# EAGLE design Main Board (EAGLE 5.10)
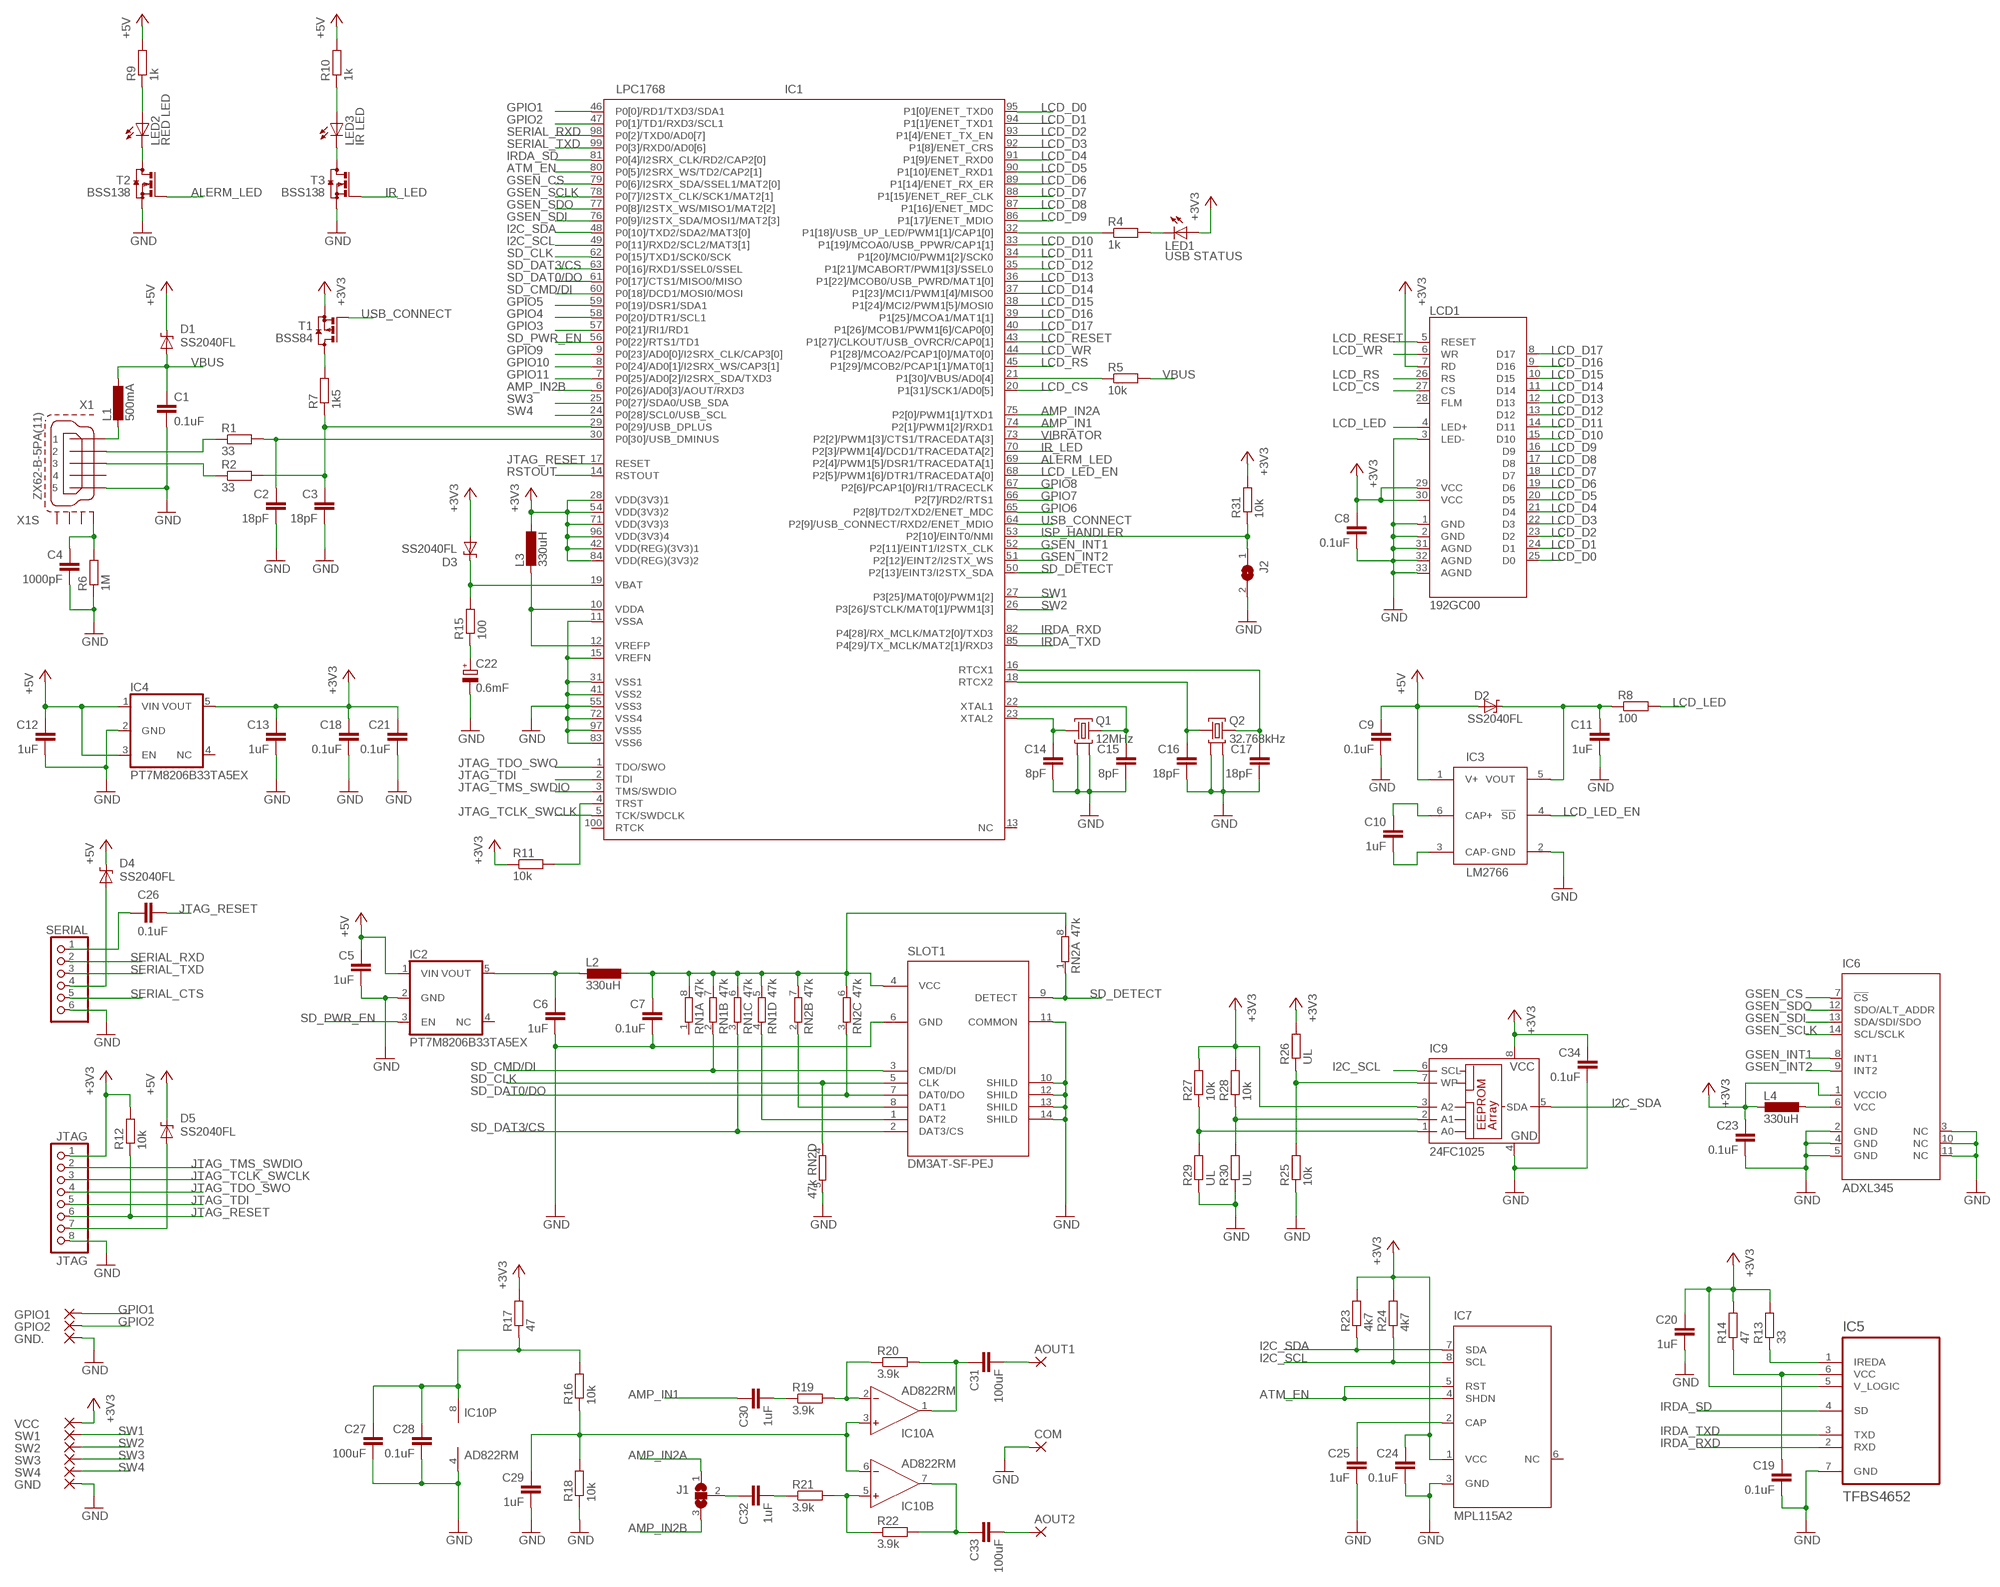
[diagram p0: schematic, sheet 1]

## Parts
AOUT1  SMD2  [SMD1,27-2,54]
AOUT2  SMD2  [SMD1,27-2,54]
C1  0.1uF  C-EUC0402  [C0402]
C2  18pF  C-EUC0402  [C0402]
C3  18pF  C-EUC0402  [C0402]
C4  1000pF  C-EUC0402  [C0402]
C5  1uF  C-EUC0402  [C0402]
C6  1uF  C-EUC0402  [C0402]
C7  0.1uF  C-EUC0402  [C0402]
C8  0.1uF  C-EUC0402  [C0402]
C9  0.1uF  C-EUC0402  [C0402]
C10  1uF  C-EUC0402  [C0402]
C11  1uF  C-EUC0402  [C0402]
C12  1uF  C-EUC0402  [C0402]
C13  1uF  C-EUC0402  [C0402]
C14  8pF  C-EUC0402  [C0402]
C15  8pF  C-EUC0402  [C0402]
C16  18pF  C-EUC0402  [C0402]
C17  18pF  C-EUC0402  [C0402]
C18  0.1uF  C-EUC0402  [C0402]
C19  0.1uF  C-EUC0402  [C0402]
C20  1uF  C-EUC0402  [C0402]
C21  0.1uF  C-EUC0402  [C0402]
C22  0.6mF  PAS414HR-VA5R  [414-VA5R]
C23  0.1uF  C-EUC0402  [C0402]
C24  0.1uF  C-EUC0402  [C0402]
C25  1uF  C-EUC0402  [C0402]
C26  0.1uF  C-EUC0402  [C0402]
C27  100uF  C-EUC1206  [C1206]
C28  0.1uF  C-EUC0402  [C0402]
C29  1uF  C-EUC0402  [C0402]
C30  1uF  C-EUC0402  [C0402]
C31  100uF  C-EUC1206  [C1206]
C32  1uF  C-EUC0402  [C0402]
C33  100uF  C-EUC1206  [C1206]
C34  0.1uF  C-EUC0402  [C0402]
COM  SMD2  [SMD1,27-2,54]
D1  SS2040FL  [SOD-123FL]
D2  SS2040FL  [SOD-123FL]
D3  SS2040FL  [SOD-123FL]
D4  SS2040FL  [SOD-123FL]
D5  SS2040FL  [SOD-123FL]
GND  SMD2  [SMD1,27-2,54]
GND.  SMD2  [SMD1,27-2,54]
GPIO1  SMD2  [SMD1,27-2,54]
GPIO2  SMD2  [SMD1,27-2,54]
IC1  LPC1768  [LQFP100-14X14]
IC2  PT7M8206B33TA5EX  [SOT23-5L]
IC3  LM2766  [SOT23-6]
IC4  PT7M8206B33TA5EX  [SOT23-5L]
IC5  TFBS4652  [TFBS4652]
IC6  ADXL345  [LGA14]
IC7  MPL115A2  [LGA8]
IC9  24FC1025  24AA01SN  [SO-08]
IC10  AD822RM  [MSOP08]
J1  SJ2W  [SJ_2]
J2  SJ  [SJ]
JTAG  JTAG  PINHD-1X8  [1X08]
L1  500mA  L-EUL1812  [L1812]
L2  330uH  L-EUL2012C  [L2012C]
L3  330uH  L-EUL2012C  [L2012C]
L4  330uH  L-EUL2012C  [L2012C]
LCD1  192GC00  [192GC00]
LED1  USB STATUS  LEDCHIP-LED0603  [CHIP-LED0603]
LED2  RED LED  LEDKA-3528ASYC  [KA-3528ASYC]
LED3  IR LED  LEDKA-3528ASYC  [KA-3528ASYC]
Q1  12MHz  NX3225SA  [DFN]
Q2  32.768kHz  ECX-71  [DFN]
R1  33  R-EU_R0402  [R0402]
R2  33  R-EU_R0402  [R0402]
R4  1k  R-EU_R0402  [R0402]
R5  10k  R-EU_R0402  [R0402]
R6  1M  R-EU_R0402  [R0402]
R7  1k5  R-EU_R0402  [R0402]
R8  100  R-EU_R0603  [R0603]
R9  1k  R-EU_R0402  [R0402]
R10  1k  R-EU_R0402  [R0402]
R11  10k  R-EU_R0402  [R0402]
R12  10k  R-EU_R0402  [R0402]
R13  33  R-EU_R0402  [R0402]
R14  47  R-EU_R0402  [R0402]
R15  100  R-EU_R0402  [R0402]
R16  10k  R-EU_R0402  [R0402]
R17  47  R-EU_R0402  [R0402]
R18  10k  R-EU_R0402  [R0402]
R19  3.9k  R-EU_R0402  [R0402]
R20  3.9k  R-EU_R0402  [R0402]
R21  3.9k  R-EU_R0402  [R0402]
R22  3.9k  R-EU_R0402  [R0402]
R23  4k7  R-EU_R0402  [R0402]
R24  4k7  R-EU_R0402  [R0402]
R25  10k  R-EU_R0402  [R0402]
R26  UL  R-EU_R0402  [R0402]
R27  10k  R-EU_R0402  [R0402]
R28  10k  R-EU_R0402  [R0402]
R29  UL  R-EU_R0402  [R0402]
R30  UL  R-EU_R0402  [R0402]
R31  10k  R-EU_R0402  [R0402]
RN1  47k  4R-NEXBN8V  [EXBN8V]
RN2  47k  4R-NEXBN8V  [EXBN8V]
SERIAL  PINHD-1X6  [1X06]
SLOT1  DM3AT-SF-PEJ  [DM3AT-SF-PEJ]
SW1  SMD2  [SMD1,27-2,54]
SW2  SMD2  [SMD1,27-2,54]
SW3  SMD2  [SMD1,27-2,54]
SW4  SMD2  [SMD1,27-2,54]
T1  BSS84  [SOT23]
T2  BSS138  BSS123  [SOT23]
T3  BSS138  BSS123  [SOT23]
VCC  SMD2  [SMD1,27-2,54]
X1  ZX62-B-5PA(11)  [ZX62-B-5PA(11)]

## Nets
+3V3: C8.1 C13.1 C18.1 C20.1 C21.1 C23.1 C24.1 C34.1 D3.A IC1.28(VDD(3V3)1) IC1.42(VDD(REG)(3V3)1) IC1.54(VDD(3V3)2) IC1.71(VDD(3V3)3) IC1.84(VDD(REG)(3V3)2) IC1.96(VDD(3V3)4) IC4.5(VOUT) IC5.5(V_LOGIC) IC6.1(VCCIO) IC7.1(VCC) IC9.3(A2) IC9.8(VCC) JTAG.1 L3.1 L4.2 LCD1.7(RD) LCD1.29(VCC) LCD1.30(VCC) LED1.A R11.1 R12.2 R13.2 R14.2 R17.2 R23.2 R24.2 R26.2 R27.2 R28.2 R31.2 T1.2(S) VCC.1(P)
+5V: C5.1 C9.1 C12.1 D1.C D2.A D4.C D5.C IC2.1(VIN) IC3.1(V+) IC4.1(VIN) IC4.3(EN) R9.2 R10.2
ALERM_LED: IC1.69(P2[4]/PWM1[5]/DSR1/TRACEDATA[1]) T2.1(G)
AMP_IN1: C30.1 IC1.74(P2[1]/PWM1[2]/RXD1)
AMP_IN2A: IC1.75(P2[0]/PWM1[1]/TXD1) J1.1
AMP_IN2B: IC1.6(P0[26]/AD0[3]/AOUT/RXD3) J1.3
ATM_EN: IC1.80(P0[5]/I2SRX_WS/TD2/CAP2[1]) IC7.4(SHDN) IC7.5(RST)
EXT_POWER: D5.A JTAG.7
GND: C1.2 C2.2 C3.2 C4.2 C5.2 C6.2 C7.2 C8.2 C9.2 C11.2 C12.2 C13.2 C14.2 C15.2 C16.2 C17.2 C18.2 C19.2 C20.2 C21.2 C22.- C23.2 C24.2 C25.2 C27.2 C28.2 C29.2 C34.2 COM.1(P) GND.1(P) GND..1(P) IC1.11(VSSA) IC1.15(VREFN) IC1.31(VSS1) IC1.41(VSS2) IC1.55(VSS3) IC1.72(VSS4) IC1.83(VSS6) IC1.97(VSS5) IC2.2(GND) IC3.2(GND) IC4.2(GND) IC5.7(GND) IC6.2(GND) IC6.3(NC) IC6.4(GND) IC6.5(GND) IC6.10(NC) IC6.11(NC) IC7.3(GND) IC9.4(GND) IC10.4(P:V-) J2.2 JTAG.8 LCD1.1(GND) LCD1.2(GND) LCD1.3(LED-) LCD1.31(AGND) LCD1.32(AGND) LCD1.33(AGND) Q1.2 Q1.4 Q2.2 Q2.3 R6.1 R18.1 R25.1 R29.1 R30.1 RN2.5 SERIAL.6 SLOT1.6(GND) SLOT1.10(SHILD) SLOT1.11(COMMON) SLOT1.12(SHILD) SLOT1.13(SHILD) SLOT1.14(SHILD) T2.2(S) T3.2(S) X1.5
GPIO1: GPIO1.1(P) IC1.46(P0[0]/RD1/TXD3/SDA1)
GPIO2: GPIO2.1(P) IC1.47(P0[1]/TD1/RXD3/SCL1)
GPIO3: IC1.57(P0[21]/RI1/RD1)
GPIO4: IC1.58(P0[20]/DTR1/SCL1)
GPIO5: IC1.59(P0[19]/DSR1/SDA1)
GPIO6: IC1.65(P2[8]/TD2/TXD2/ENET_MDC)
GPIO7: IC1.66(P2[7]/RD2/RTS1)
GPIO8: IC1.67(P2[6]/PCAP1[0]/RI1/TRACECLK)
GPIO9: IC1.9(P0[23]/AD0[0]/I2SRX_CLK/CAP3[0])
GPIO10: IC1.8(P0[24]/AD0[1]/I2SRX_WS/CAP3[1])
GPIO11: IC1.7(P0[25]/AD0[2]/I2SRX_SDA/TXD3)
GSEN_CS: IC1.79(P0[6]/I2SRX_SDA/SSEL1/MAT2[0]) IC6.7(!CS)
GSEN_INT1: IC1.52(P2[11]/EINT1/I2STX_CLK) IC6.8(INT1)
GSEN_INT2: IC1.51(P2[12]/EINT2/I2STX_WS) IC6.9(INT2)
GSEN_SCLK: IC1.78(P0[7]/I2STX_CLK/SCK1/MAT2[1]) IC6.14(SCL/SCLK)
GSEN_SDI: IC1.76(P0[9]/I2STX_SDA/MOSI1/MAT2[3]) IC6.13(SDA/SDI/SDO)
GSEN_SDO: IC1.77(P0[8]/I2STX_WS/MISO1/MAT2[2]) IC6.12(SDO/ALT_ADDR)
I2C_SCL: IC1.49(P0[11]/RXD2/SCL2/MAT3[1]) IC7.8(SCL) IC9.6(SCL) R24.1
I2C_SDA: IC1.48(P0[10]/TXD2/SDA2/MAT3[0]) IC7.7(SDA) IC9.5(SDA) R23.1
IR_LED: IC1.70(P2[3]/PWM1[4]/DCD1/TRACEDATA[2]) T3.1(G)
IRDA_RXD: IC1.82(P4[28]/RX_MCLK/MAT2[0]/TXD3) IC5.2(RXD)
IRDA_SD: IC1.81(P0[4]/I2SRX_CLK/RD2/CAP2[0]) IC5.4(SD)
IRDA_TXD: IC1.85(P4[29]/TX_MCLK/MAT2[1]/RXD3) IC5.3(TXD)
ISP_HANDLER: IC1.53(P2[10]/EINT0/NMI) J2.1 R31.1
JTAG_RESET: C26.2 IC1.17(RESET) JTAG.6 R12.1
JTAG_TCLK_SWCLK: IC1.5(TCK/SWDCLK) JTAG.3
JTAG_TDI: IC1.2(TDI) JTAG.5
JTAG_TDO_SWO: IC1.1(TDO/SWO) JTAG.4
JTAG_TMS_SWDIO: IC1.3(TMS/SWDIO) JTAG.2
LCD_CS: IC1.20(P1[31]/SCK1/AD0[5]) LCD1.27(CS)
LCD_D0: IC1.95(P1[0]/ENET_TXD0) LCD1.25(D0)
LCD_D1: IC1.94(P1[1]/ENET_TXD1) LCD1.24(D1)
LCD_D2: IC1.93(P1[4]/ENET_TX_EN) LCD1.23(D2)
LCD_D3: IC1.92(P1[8]/ENET_CRS) LCD1.22(D3)
LCD_D4: IC1.91(P1[9]/ENET_RXD0) LCD1.21(D4)
LCD_D5: IC1.90(P1[10]/ENET_RXD1) LCD1.20(D5)
LCD_D6: IC1.89(P1[14]/ENET_RX_ER) LCD1.19(D6)
LCD_D7: IC1.88(P1[15]/ENET_REF_CLK) LCD1.18(D7)
LCD_D8: IC1.87(P1[16]/ENET_MDC) LCD1.17(D8)
LCD_D9: IC1.86(P1[17]/ENET_MDIO) LCD1.16(D9)
LCD_D10: IC1.33(P1[19]/MCOA0/USB_PPWR/CAP1[1]) LCD1.15(D10)
LCD_D11: IC1.34(P1[20]/MCI0/PWM1[2]/SCK0) LCD1.14(D11)
LCD_D12: IC1.35(P1[21]/MCABORT/PWM1[3]/SSEL0) LCD1.13(D12)
LCD_D13: IC1.36(P1[22]/MCOB0/USB_PWRD/MAT1[0]) LCD1.12(D13)
LCD_D14: IC1.37(P1[23]/MCI1/PWM1[4]/MISO0) LCD1.11(D14)
LCD_D15: IC1.38(P1[24]/MCI2/PWM1[5]/MOSI0) LCD1.10(D15)
LCD_D16: IC1.39(P1[25]/MCOA1/MAT1[1]) LCD1.9(D16)
LCD_D17: IC1.40(P1[26]/MCOB1/PWM1[6]/CAP0[0]) LCD1.8(D17)
LCD_LED: LCD1.4(LED+) R8.2
LCD_LED_EN: IC1.68(P2[5]/PWM1[6]/DTR1/TRACEDATA[0]) IC3.4(!SD)
LCD_RESET: IC1.43(P1[27]/CLKOUT/USB_OVRCR/CAP0[1]) LCD1.5(RESET)
LCD_RS: IC1.45(P1[29]/MCOB2/PCAP1[1]/MAT0[1]) LCD1.26(RS)
LCD_WR: IC1.44(P1[28]/MCOA2/PCAP1[0]/MAT0[0]) LCD1.6(WR)
N$1: C4.1 R6.2 X1.M1(S1)
N$2: R1.1 X1.2
N$3: R2.1 X1.3
N$4: L1.2 X1.1
N$5: D3.C IC1.19(VBAT) R15.2
N$6: R7.2 T1.3(D)
N$7: C3.1 IC1.29(P0[29]/USB_DPLUS) R2.2 R7.1
N$8: IC1.10(VDDA) IC1.12(VREFP) L3.2
N$9: C2.1 IC1.30(P0[30]/USB_DMINUS) R1.2
N$10: C10.2 IC3.3(CAP-)
N$11: C15.1 IC1.22(XTAL1) Q1.3
N$12: C14.1 IC1.23(XTAL2) Q1.1
N$13: IC1.32(P1[18]/USB_UP_LED/PWM1[1]/CAP1[0]) R4.1
N$14: LED1.C R4.2
N$15: C17.1 IC1.16(RTCX1) Q2.1
N$16: C16.1 IC1.18(RTCX2) Q2.4
N$17: C10.1 IC3.6(CAP+)
N$18: IC1.4(TRST) R11.2
N$19: D4.A SERIAL.4
N$20: C11.1 D2.C IC3.5(VOUT) R8.1
N$21: C22.+ R15.1
N$22: IC1.21(P1[30]/VBUS/AD0[4]) R5.1
N$23: IC6.6(VCC) L4.1
N$24: C19.1 IC5.6(VCC) R14.1
N$25: C6.1 IC2.5(VOUT) L2.2
N$27: C26.1 SERIAL.1
N$28: C32.1 J1.2
N$30: LED3.C T3.3(D)
N$31: LED2.C T2.3(D)
N$32: IC9.1(A0) R27.1 R29.2
N$33: IC9.2(A1) R28.1 R30.2
N$34: LED3.A R10.1
N$35: IC5.1(IREDA) R13.1
N$40: AOUT1.1(P) C31.2
N$41: LED2.A R9.1
N$43: IC9.7(WP) R25.2 R26.1
N$51: IC10.2(A:IN-) R19.2 R20.1
N$52: IC10.5(B:IN+) R21.2 R22.1
N$53: C30.2 R19.1
N$54: C32.2 R21.1
N$56: C27.1 C28.1 IC10.8(P:V+) R16.2 R17.1
N$57: C29.1 IC10.3(A:IN+) IC10.6(B:IN-) R16.1 R18.2
N$58: AOUT2.1(P) C33.2
N$59: C33.1 IC10.7(B:OUT) R22.2
N$60: C31.1 IC10.1(A:OUT) R20.2
N$63: C25.1 IC7.2(CAP)
RSTOUT: IC1.14(RSTOUT)
SD_CLK: IC1.62(P0[15]/TXD1/SCK0/SCK) RN2.4 SLOT1.5(CLK)
SD_CMD/DI: IC1.60(P0[18]/DCD1/MOSI0/MOSI) RN1.2 SLOT1.3(CMD/DI)
SD_DAT0/DO: IC1.61(P0[17]/CTS1/MISO0/MISO) RN2.3 SLOT1.7(DAT0/DO)
SD_DAT1: RN2.2 SLOT1.8(DAT1)
SD_DAT2: RN1.4 SLOT1.1(DAT2)
SD_DAT3/CS: IC1.63(P0[16]/RXD1/SSEL0/SSEL) RN1.3 SLOT1.2(DAT3/CS)
SD_DETECT: IC1.50(P2[13]/EINT3/I2STX_SDA) RN2.1 SLOT1.9(DETECT)
SD_PWR_EN: IC1.56(P0[22]/RTS1/TD1) IC2.3(EN)
SERIAL_CTS: SERIAL.5
SERIAL_RXD: IC1.98(P0[2]/TXD0/AD0[7]) SERIAL.2
SERIAL_TXD: IC1.99(P0[3]/RXD0/AD0[6]) SERIAL.3
SW1: IC1.27(P3[25]/MAT0[0]/PWM1[2]) SW1.1(P)
SW2: IC1.26(P3[26]/STCLK/MAT0[1]/PWM1[3]) SW2.1(P)
SW3: IC1.25(P0[27]/SDA0/USB_SDA) SW3.1(P)
SW4: IC1.24(P0[28]/SCL0/USB_SCL) SW4.1(P)
USB_CONNECT: IC1.64(P2[9]/USB_CONNECT/RXD2/ENET_MDIO) T1.1(G)
VBUS: C1.1 D1.A L1.1 R5.2
VCC: C7.1 L2.1 RN1.5 RN1.6 RN1.7 RN1.8 RN2.6 RN2.7 RN2.8 SLOT1.4(VCC)
VIBRATOR: IC1.73(P2[2]/PWM1[3]/CTS1/TRACEDATA[3])
Unconnected: IC1.13(NC) IC1.100(RTCK) IC2.4(NC) IC4.4(NC) IC7.6(NC) LCD1.28(FLM) RN1.1 X1.4 X1.M2(S2) X1.M3(S3) X1.M4(S4)

## Library data of the parts
AOUT1 AOUT2 COM GND GND. GPIO1 GPIO2 SW1-SW4 VCC = wirepad:SMD2: SMD PAD
C1-C21 C23-C34 = resistor:C-EU: CAPACITOR, European symbol
C22 = taiyo yuden:PAS414HR-VA5R: Coin Type PAS Capacitor 414-VE5R Voltage: 3.3V Capacitor: 60mF Diameter: 4.8mm Height: 1.62mm
D1-D5 = PANJIT:SS2040FL: Schottky Barrier Diode 40V 2.0A
IC1 = lpc1xxx-v6:LPC1768: LPC1768 100 MHz 32-bit ARM Cortex-M3 based microcontroller featuring a high level of integration and low power consumption. 512 kB Flash, 64 kB SRAM, USB Device/Host/OTG, 2 CAN, DAC, Ethernet MarcVl - Datasheet available on www.nxp.com
IC2 IC4 = pericom technology:PT7M8206B33TA5EX: 300mA Low Noise LDO Voltage Regulator with Enable Source: http://www.pti-ic.com/new/manage/doc_datasheet/PT0359%20PT7M8206-1.pdf
IC3 = national_semiconductor:LM2766: Switched Capacitor Voltage Converter Manufacturer: http://cache.national.com Source: http://www.national.com/ds/LM/LM2766.pdf
IC5 = Vishay Semiconductors:TFBS4652: Infrared Transceiver, 9.6 kbit/s to 115.2 kbit/s (SIR) source: http://www.vishay.com/docs/84671/tfbs4652.pdf
IC6 = analog-devices:ADXL345: ADXL345 3-Axis, 2g/4g/8g/16g Digital Accelerometer in LGA14 Package Voltage: 2.0V-3.6V SPI(3-4wire), I2C
IC7 = Freescale:MPL115A2: Miniature I2C Digital Barometer in LGA8 Package - Digitized pressure and temperature information together with programmed calibration coefficients for host micro use - Factory Calibrated - 50 kPa to 115 kPa Absolute Pressure - 1 kPa Accuracy - 2.375 V to 5.5 V Supply - Integrated ADC - I2C Interface - Monotonic Pressure and Temperature Data Outputs
IC9 = microchip:24*: Serial EEPROM I2C
IC10 = analog-devices:AD822: Single-Supply, Rail-to-Rail Low Power FET-Input Op Amp Source: http://www.analog.com/static/imported-files/data_sheets/AD822.pdf
J1 = jumper:SJ2W: SMD solder JUMPER
J2 = jumper:SJ: SMD solder JUMPER
JTAG = pinheader:PINHD-1X8: PIN HEADER
L1-L4 = resistor:L-EU: INDUCTOR, European symbol
LCD1 = repro:192GC00: TFT DISPLAY 192GC00 320x240 262K color
LED1-LED3 = led:LED: LED OSRAM: - CHIPLED LG R971, LG N971, LY N971, LG Q971, LY Q971, LO R971, LY R971 LH N974, LH R974 LS Q976, LO Q976, LY Q976 LO Q996 - Hyper CHIPLED LW Q18S LB Q993, LB Q99A, LB R99A - SideLED LS A670, LO A670, LY A670, LG A670, LP A670 LB A673, LV A673, LT A673, LW A673 LH A674 LY A675 LS A676, LA A676, LO A676, LY A676, LW A676 LS A679, LY A679, LG A679 - Hyper Micro SIDELED® LS Y876, LA Y876, LO Y876, LY Y876 LT Y87S - SmartLED LW L88C, LW L88S LB L89C, LB L89S, LG L890 LS L89K, LO L89K, LY L89K LS L896, LA L896, LO L896, LY L896 - TOPLED LS T670, LO T670, LY T670, LG T670, LP T670 LSG T670, LSP T670, LSY T670, LOP T670, LYG T670 LG T671, LOG T671, LSG T671 LB T673, LV T673, LT T673, LW T673 LH T674 LS T676, LA T676, LO T676, LY T676, LB T676, LH T676, LSB T676, LW T676 LB T67C, LV T67C, LT T67C, LS T67K, LO T67K, LY T67K, LW E67C LS E67B, LA E67B, LO E67B, LY E67B, LB E67C, LV E67C, LT E67C LW T67C LS T679, LY T679, LG T679 LS T770, LO T770, LY T770, LG T770, LP T770 LB T773, LV T773, LT T773, LW T773 LH T774 LS E675, LA E675, LY E675, LS T675 LS T776, LA T776, LO T776, LY T776, LB T776 LHGB T686 LT T68C, LB T68C - Hyper Mini TOPLED® LB M676 - Mini TOPLED Santana® LG M470 LS M47K, LO M47K, LY M47K Source: http://www.osram.convergy.de LUXEON: - LUMILED® LXK2-PW12-R00, LXK2-PW12-S00, LXK2-PW14-U00, LXK2-PW14-V00 LXK2-PM12-R00, LXK2-PM12-S00, LXK2-PM14-U00 LXK2-PE12-Q00, LXK2-PE12-R00, LXK2-PE12-S00, LXK2-PE14-T00, LXK2-PE14-U00 LXK2-PB12-K00, LXK2-PB12-L00, LXK2-PB12-M00, LXK2-PB14-N00, LXK2-PB14-P00, LXK2-PB14-Q00 LXK2-PR12-L00, LXK2-PR12-M00, LXK2-PR14-Q00, LXK2-PR14-R00 LXK2-PD12-Q00, LXK2-PD12-R00, LXK2-PD12-S00 LXK2-PH12-R00, LXK2-PH12-S00 LXK2-PL12-P00, LXK2-PL12-Q00, LXK2-PL12-R00 Source: www.luxeon.com KINGBRIGHT: KA-3528ASYC Source: www.kingbright.com
Q1 = NDK:NX3225SA: CRYSTAL CLOCK OSCILLATORS
Q2 = ECS:ECX-71: CRYSTAL CLOCK OSCILLATORS 32.768kHz
R1 R2 R4-R31 = resistor:R-EU_: RESISTOR, European symbol
RN1 RN2 = resistor-dil:4R-N: Array Chip Resistor Source: RS Component / Phycomp
SERIAL = pinheader:PINHD-1X6: PIN HEADER
SLOT1 = hirose:DM3AT-SF-PEJ: micro SD Card (Standard Type) Source: http://www.hirose.co.jp/catalogj_hp/j60900232.pdf
T1 = transistor-small-signal:BSS84: P-CHANNEL MOS FET
T2 T3 = transistor-small-signal:BSS123: N-CHANNEL MOS FET
X1 = micro-usb:ZX62-B-5PA(11): MICRO USB Connector

## Board
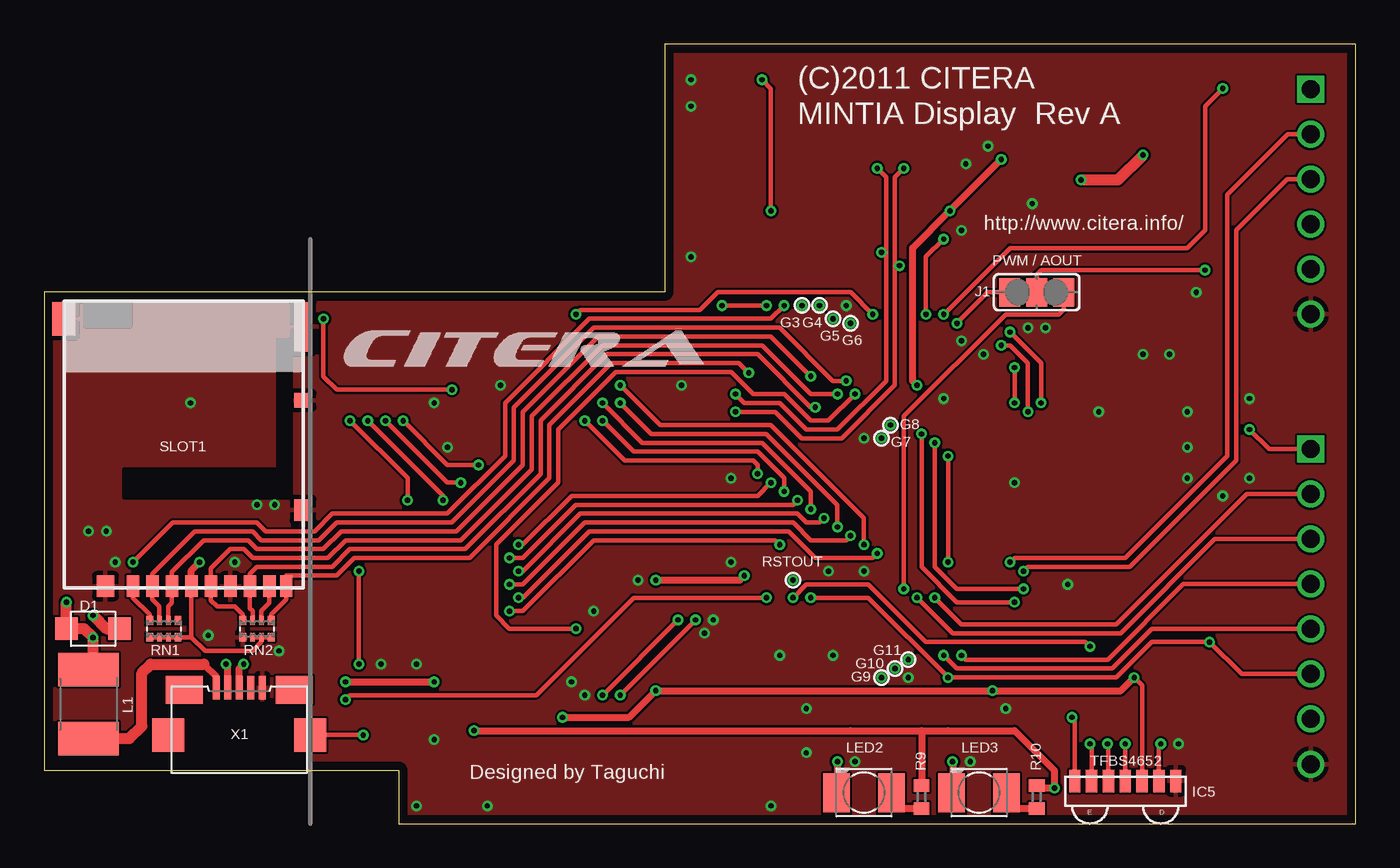
[diagram p1: board, top side]
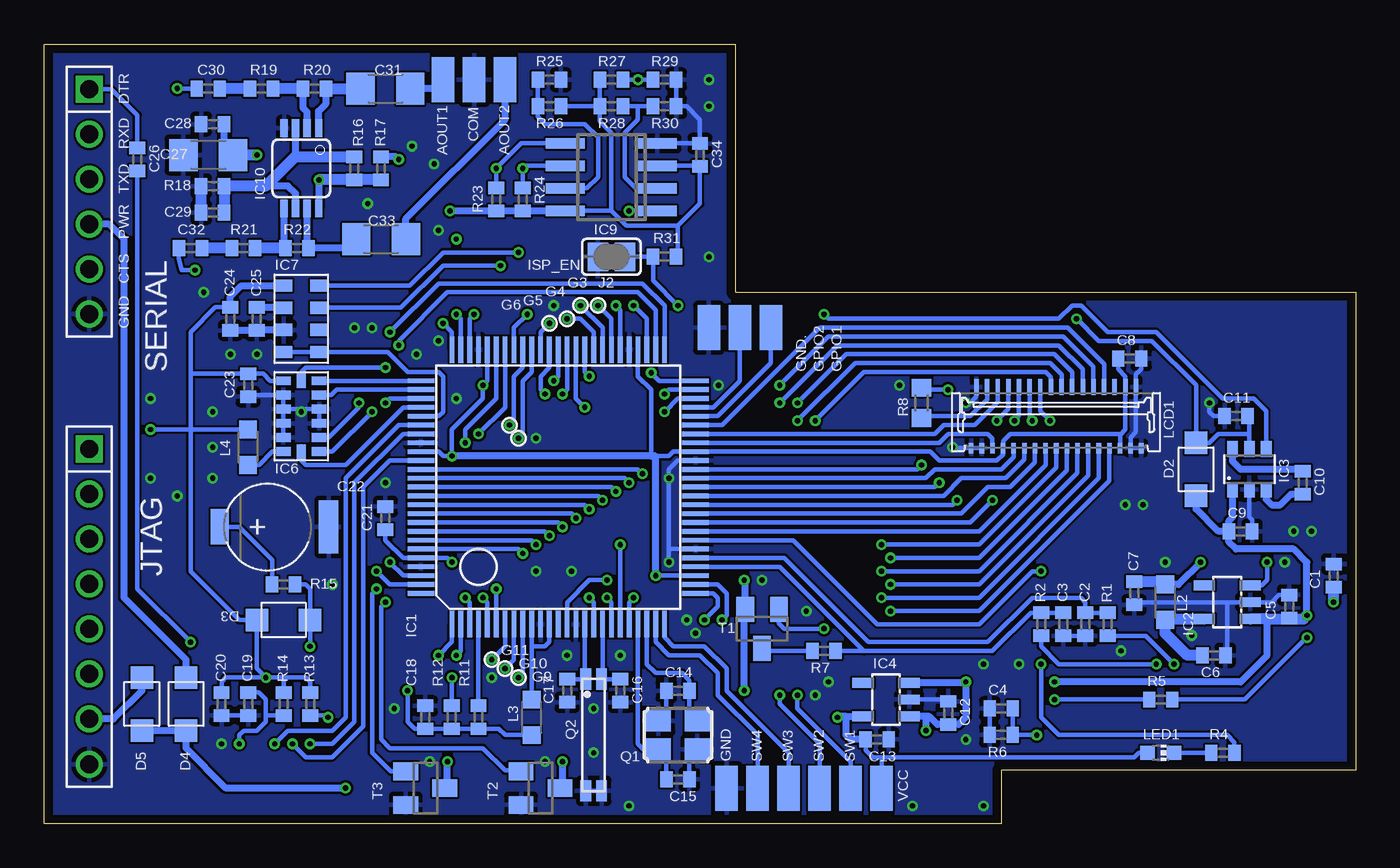
[diagram p2: board, bottom side, seen from below]

Size 74 x 44 mm. Coordinates in mm from the lower left corner, seen from the top.
Outline: 74,44 35,44 35,30 0,30 0,3 20,3 20,0 74,0 74,44
Copper layers (1+2*15+16): Top 0.018mm / dielectric 0.25mm / Route2 0.035mm / dielectric 1mm / Route15 0.035mm / dielectric 0.25mm / Bottom 0.018mm
Design rules "pban_5mil-l4": minimum track width 5mil, minimum drill 0.3mm, track to track 5mil, track to pad 0.229mm, pad to pad 5mil, via to via 5mil, smd to smd 5mil, copper to edge 0.5mm, drill to drill 0.5mm, minimum pad ring 0.15mm, minimum via ring 0.15mm, stop-mask expansion 4mil, vias tented up to drill 0.35mm, thermal gap 10mil

### Footprints (pad centres in the part's own frame; a part is rotated, then mirrored left to right if it is on the bottom)
SMD1,27-2,54 = smd 1.27 x 2.54: 1 0,0
C0402 = smd 0.7 x 0.9: 1 -0.65,0; 2 0.65,0
414-VA5R = smd 1 x 2: + -2.6,0 | smd 1.1 x 3: - 3.55,0
C1206 = smd 1.6 x 1.8: 1 -1.4,0; 2 1.4,0
SOD-123FL = smd 1.27 x 1.27: A 1.5,0; C -1.5,0
LQFP100-14X14 = smd 0.27 x 1.5: 1 -6,-7.75; 2 -5.5,-7.75; 3 -5,-7.75; 4 -4.5,-7.75; 5 -4,-7.75; 6 -3.5,-7.75; 7 -3,-7.75; 8 -2.5,-7.75; 9 -2,-7.75; 10 -1.5,-7.75; 11 -1,-7.75; 12 -0.5,-7.75; 13 0,-7.75; 14 0.5,-7.75; 15 1,-7.75; 16 1.5,-7.75; 17 2,-7.75; 18 2.5,-7.75; 19 3,-7.75; 20 3.5,-7.75; 21 4,-7.75; 22 4.5,-7.75; 23 5,-7.75; 24 5.5,-7.75; 25 6,-7.75; 51 6,7.75; 52 5.5,7.75; 53 5,7.75; 54 4.5,7.75; 55 4,7.75; 56 3.5,7.75; 57 3,7.75; 58 2.5,7.75; 59 2,7.75; 60 1.5,7.75; 61 1,7.75; 62 0.5,7.75; 63 0,7.75; 64 -0.5,7.75; 65 -1,7.75; 66 -1.5,7.75; 67 -2,7.75; 68 -2.5,7.75; 69 -3,7.75; 70 -3.5,7.75; 71 -4,7.75; 72 -4.5,7.75; 73 -5,7.75; 74 -5.5,7.75; 75 -6,7.75 | smd 1.5 x 0.27: 26 7.75,-6; 27 7.75,-5.5; 28 7.75,-5; 29 7.75,-4.5; 30 7.75,-4; 31 7.75,-3.5; 32 7.75,-3; 33 7.75,-2.5; 34 7.75,-2; 35 7.75,-1.5; 36 7.75,-1; 37 7.75,-0.5; 38 7.75,0; 39 7.75,0.5; 40 7.75,1; 41 7.75,1.5; 42 7.75,2; 43 7.75,2.5; 44 7.75,3; 45 7.75,3.5; 46 7.75,4; 47 7.75,4.5; 48 7.75,5; 49 7.75,5.5; 50 7.75,6; 76 -7.75,6; 77 -7.75,5.5; 78 -7.75,5; 79 -7.75,4.5; 80 -7.75,4; 81 -7.75,3.5; 82 -7.75,3; 83 -7.75,2.5; 84 -7.75,2; 85 -7.75,1.5; 86 -7.75,1; 87 -7.75,0.5; 88 -7.75,0; 89 -7.75,-0.5; 90 -7.75,-1; 91 -7.75,-1.5; 92 -7.75,-2; 93 -7.75,-2.5; 94 -7.75,-3; 95 -7.75,-3.5; 96 -7.75,-4; 97 -7.75,-4.5; 98 -7.75,-5; 99 -7.75,-5.5; 100 -7.75,-6
SOT23-5L = smd 0.55 x 1.2: 1 -0.95,-1.3; 2 0,-1.3; 3 0.95,-1.3; 4 0.95,1.3; 5 -0.95,1.3
SOT23-6 = smd 0.6 x 0.9: 1 -0.95,-1.15; 2 0,-1.15; 3 0.95,-1.15; 4 0.95,1.15; 5 0,1.15; 6 -0.95,1.15
TFBS4652 = smd 0.64 x 1.27: 1 2.85,-0.665; 2 1.9,-0.665; 3 0.95,-0.665; 4 0,-0.665; 5 -0.95,-0.665; 6 -1.9,-0.665; 7 -2.85,-0.665
LGA14 = smd 0.813 x 0.5: 1 -1.01,2; 2 -1.01,1.2; 3 -1.01,0.4; 4 -1.01,-0.4; 5 -1.01,-1.2; 6 -1.01,-2; 8 1.01,-2; 9 1.01,-1.2; 10 1.01,-0.4; 11 1.01,0.4; 12 1.01,1.2; 13 1.01,2 | smd 0.5 x 0.813: 7 0,-2.01; 14 0,2.01
LGA8 = smd 1 x 0.7: 1 -1,1.875; 2 -1,0.625; 3 -1,-0.625; 4 -1,-1.875; 5 1,-1.875; 6 1,-0.625; 7 1,0.625; 8 1,1.875
SO-08 = smd 0.6 x 2.2: 1 -1.905,-2.6; 2 -0.635,-2.6; 3 0.635,-2.6; 4 1.905,-2.6; 5 1.905,2.6; 6 0.635,2.6; 7 -0.635,2.6; 8 -1.905,2.6
MSOP08 = smd 0.4 x 1: 1 -0.976,-2.263; 2 -0.326,-2.263; 3 0.324,-2.263; 4 0.974,-2.263; 5 0.974,2.262; 6 0.324,2.262; 7 -0.326,2.262; 8 -0.976,2.262
SJ_2 = smd 1.168 x 1.6: 1 -1.524,0; 2 0,0; 3 1.524,0
SJ = smd 1.168 x 1.6: 1 -0.762,0; 2 0.762,0
1X08 = drill 1.016 square: 1 -8.89,0 | drill 1.016 round: 2 -6.35,0; 3 -3.81,0; 4 -1.27,0; 5 1.27,0; 6 3.81,0; 7 6.35,0; 8 8.89,0
L1812 = smd 1.9 x 3.4: 1 -1.95,0; 2 1.95,0
L2012C = smd 1 x 1: 1 -1,0; 2 1,0
192GC00 = smd 0.6 x 0.26: 1 -1.8,5.7; 3 -1.8,5.1; 5 -1.8,4.5; 7 -1.8,3.9; 9 -1.8,3.3; 11 -1.8,2.7; 13 -1.8,2.1; 15 -1.8,1.5; 17 -1.8,0.9; 19 -1.8,0.3; 21 -1.8,-0.3; 23 -1.8,-0.9; 25 -1.8,-1.5; 27 -1.8,-2.1; 29 -1.8,-2.7; 31 -1.8,-3.3; 33 -1.8,-3.9 | smd 0.9 x 0.25: 2 1.65,5.4; 4 1.65,4.8; 6 1.65,4.2; 8 1.65,3.6; 10 1.65,3; 12 1.65,2.4; 14 1.65,1.8; 16 1.65,1.2; 18 1.65,0.6; 20 1.65,0; 22 1.65,-0.6; 24 1.65,-1.2; 26 1.65,-1.8; 28 1.65,-2.4; 30 1.65,-3; 32 1.65,-3.6
CHIP-LED0603 = smd 0.8 x 0.8: A 0,-0.75; C 0,0.75
KA-3528ASYC = smd 1.5 x 2.2: A -1.55,0; C 1.55,0
DFN = smd 1.4 x 1.2: 1 -1.1,-0.8; 2 1.1,-0.8; 3 1.1,0.8; 4 -1.1,0.8
DFN' = smd 1.2 x 0.6: 1 -3.15,-0.45; 2 3.15,-0.45; 3 3.15,0.45; 4 -3.15,0.45
R0402 = smd 0.7 x 0.9: 1 -0.65,0; 2 0.65,0
R0603 = smd 1 x 1.1: 1 -0.85,0; 2 0.85,0
EXBN8V = smd 0.38 x 0.5: 1 -0.8,-0.475; 4 0.8,-0.475; 5 0.8,0.475; 8 -0.8,0.475 | smd 0.25 x 0.5: 2 -0.25,-0.475; 3 0.25,-0.475; 6 0.25,0.475; 7 -0.25,0.475
1X06 = drill 1.016 square: 1 -6.35,0 | drill 1.016 round: 2 -3.81,0; 3 -1.27,0; 4 1.27,0; 5 3.81,0; 6 6.35,0
DM3AT-SF-PEJ = smd 0.7 x 1.2: 1 0,0.6; 2 -1.1,0.6; 3 -2.2,0.6; 4 -3.3,0.6; 5 -4.4,0.6; 6 -5.5,0.6; 7 -6.6,0.6; 8 -7.7,0.6; 9 -8.65,0.6 | smd 1 x 1.2: 10 -9.6,-3.7; 14 1.55,0.6 | smd 1 x 0.8: 11 -9.6,-9.9 | smd 1 x 2.8: 12 -9.6,-14.05 | smd 1.3 x 1.9: 13 3.9,-14.5
SOT23 = smd 1 x 1.4: 1 -0.95,-1.1; 2 0.95,-1.1; 3 0,1.1
ZX62-B-5PA(11) = smd 1.35 x 0.4: 1 2.675,1.3; 2 2.675,0.65; 3 2.675,0; 4 2.675,-0.65; 5 2.675,-1.3 | smd 1.9 x 1.8: M1 0,-4; M2 0,4 | smd 1.6 x 2.1: M3 2.55,3.1; M4 2.55,-3.1

### Placement (x,y rotation side)
AOUT1  51.5,42 180 bottom
AOUT2  48,42 180 bottom
C1  1.25,14 90 bottom
C2  15.25,11.25 270 bottom
C3  16.5,11.25 270 bottom
C4  20,6.5 180 bottom
C5  3.75,12.25 90 bottom
C6  8,9.5 0 bottom
C7  12.5,13 270 bottom
C8  12.75,26.25 0 bottom
C9  6.5,16.5 0 bottom
C10  3,19.25 270 bottom
C11  6.75,23 180 bottom
C12  23,6.25 90 bottom
C13  27,4.75 0 bottom
C14  38.25,7.5 180 bottom
C15  38.25,2.5 0 bottom
C16  41.5,7.5 270 bottom
C17  44.5,7.5 270 bottom
C18  52.5,6 90 bottom
C19  62.5,6.75 270 bottom
C20  64,6.75 270 bottom
C21  54.75,17.25 90 bottom
C22  61.5,16.75 0 bottom
C23  62.5,24.75 270 bottom
C24  63.5,28.5 270 bottom
C25  62,28.5 270 bottom
C26  68.75,37.5 270 bottom
C27  64.75,37.75 180 bottom
C28  64.5,39.5 180 bottom
C29  64.5,34.5 180 bottom
C30  64.75,41.5 0 bottom
C31  54.75,41.5 0 bottom
C32  65.75,32.5 0 bottom
C33  55,33 0 bottom
C34  37,37.75 90 bottom
COM  49.75,42 180 bottom
D1  2.75,11 180 top
D2  9,20 270 bottom
D3  60.5,11.5 180 bottom
D4  66,6.75 90 bottom
D5  68.5,6.75 90 bottom
GND  35.5,2 180 bottom
GND.  36.5,28 180 bottom
GPIO1  33,28 180 bottom
GPIO2  34.75,28 180 bottom
IC1  45,19 0 bottom
IC2  7.25,12.5 90 bottom
IC3  6,20 0 bottom
IC4  26.5,7 90 bottom
IC5  61,1.75 180 top
IC6  59.5,23 0 bottom
IC7  59.5,28.5 0 bottom
IC9  42,36.5 90 bottom
IC10  59.5,37 180 bottom
J1  56,30 0 top
J2  42,32 180 bottom
JTAG  71.46,12.25 270 bottom
L1  2.5,6.75 270 top
L2  10.75,12.5 270 bottom
L3  46.5,6 90 bottom
L4  62.5,21.25 90 bottom
LCD1  16,23 90 bottom
LED1  11,4 270 bottom
LED2  46.25,1.75 180 top
LED3  52.75,1.75 180 top
Q1  38.25,5 180 bottom
Q2  32.768kHz  [DFN']  43,5 270 bottom
R1  14,11.25 90 bottom
R2  17.75,11.25 90 bottom
R4  7.5,4 180 bottom
R5  11,7 0 bottom
R6  20,5 0 bottom
R7  30,9.75 180 bottom
R8  24.5,23.75 270 bottom
R9  49.5,1.5 90 top
R10  56,1.5 90 top
R11  49.5,6 90 bottom
R12  51,6 270 bottom
R13  59,6.75 90 bottom
R14  60.5,6.75 90 bottom
R15  60.5,13.5 0 bottom
R16  56.5,37 270 bottom
R17  55,37 90 bottom
R18  64.5,36 0 bottom
R19  61.75,41.5 0 bottom
R20  58.75,41.5 0 bottom
R21  62.75,32.5 0 bottom
R22  59.75,32.5 0 bottom
R23  48.5,35.25 270 bottom
R24  47,35.25 270 bottom
R25  45.5,42 180 bottom
R26  45.5,40.5 0 bottom
R27  42,42 180 bottom
R28  42,40.5 180 bottom
R29  39,42 180 bottom
R30  39,40.5 180 bottom
R31  39,32 0 bottom
RN1  6.75,11 180 top
RN2  12,11 180 top
SERIAL  71.46,35.11 270 bottom
SLOT1  5,14 180 top
SW1  28.5,2 180 bottom
SW2  30.25,2 180 bottom
SW3  32,2 180 bottom
SW4  33.75,2 180 bottom
T1  33.5,11 180 bottom
T2  46,2 270 bottom
T3  52.5,2 270 bottom
U$1  [CITERA]  16.5,25.5 0 top
VCC  26.75,2 180 bottom
X1  11,5 90 top

### Tracks (layer width: path | path; a pad name or v marks a point on that pad's centre or on a via)
+3V3  (via drill 0.3)
  Top 0.254: v51,20.75 v51,14.75 | IC5.5 61.95,7.8 v61.5,8.25 | v68,22.25 69.11,21.14 JTAG.1
  Top 0.406: v61.5,8.25 60.75,7.5 v53.5,7.5 v34.5,7.5 33,6 v29.25,6 | v34.5,13.75 39.25,13.75 v39.5,14 | v49.25,24.75 49,25 49,32.5 v51.1,34.6 v54,37.5
  Bottom 0.254: 13.3,21.95 LCD1.29 | 13.3,21.95 13,22.25 LCD1.30 13,25.25 13.4,25.65 C8.1 | 13.3,21.95 13.35,22 19.5,22 19.9,21.6 LCD1.7 19.9,20.85 20.25,20.5 23.5,20.5 24,21 IC1.42 38.5,21 38.75,20.75 39.5,20.75 | IC9.3 37,37.13 C34.1 37,35 38.25,33.75 | R28.2 R27.2 | 42,34.59 42,39 42.65,39.65 R28.2 | IC9.8 42,34.59 | 42,34.59 41.16,33.75 38.25,33.75 | IC6.1 61.25,25 61.65,25.4 C23.1 65.75,25.4 | v39.5,14 IC1.28 | 39.75,20.75 39.75,24.5 40.5,25.25 IC1.54 | IC1.71 49,25 v49.25,24.75 49.25,24 51,22.25 v51,20.75 51.5,20.75 51.75,21 IC1.84 | v51,14.75 51.25,15 IC1.96 53.75,15 54.75,16 C21.1 | C20.1 64,8 63.75,8.25 v61.5,8.25 | v61.5,8.25 60.5,8.25 | 60.5,8.25 R14.2 | R13.2 59,8 59.25,8.25 60.5,8.25 | L3.1 48,5 48.35,5.35 R11.1 R12.2 C18.1 53.1,5.35 53.5,5.75 v53.5,7.5 | 65.75,22.25 v68,22.25 | 65.75,22.25 L4.2 | R28.2 R26.2 | v61.5,8.25 62,8.75 D3.A 63,11.5 65.75,14.25 65.75,22.25 | C24.1 64.35,29.15 65.75,27.75 65.75,25.4 | 65.75,22.25 65.75,25.4 | R31.2 38.25,32 38.25,33.75 | LED1.A 12.25,4 12.5,3.75 26.75,3.75 | C13.1 27.65,4.15 27.25,3.75 26.75,3.75 | 26.75,3.75 VCC.1
  Bottom 0.406: C13.1 28.5,4.75 28.75,5 28.75,6.05 | v39.5,14 39.5,20.75 39.75,20.75 v51,20.75 | v34.5,7.5 34.5,12.05 T1.2 34.45,13.75 v34.5,13.75 | 28.75,6.05 IC4.5 | IC9.8 R24.2 R23.2 v51.1,34.6 | IC7.1 62.88,30.38 63.5,29.75 C24.1 | v54,37.5 54.15,37.65 R17.2 | 28.75,6.05 29.25,6.05 v29.25,6
+5V  (via drill 0.3)
  Top 0.254: 51,5.25 51.35,5.25 | 45.5,5.25 45.6,5.25
  Top 0.406: 49.5,5.25 51,5.25 54.75,5.25 57,3 v57,2 55.75,2 R10.2 | v24.25,5.25 45.5,5.25 49.5,5.25 | v17,8 v22,8 | 49.5,5.25 R9.2
  Top 0.61: D1.C 3.5,11 v2.75,11.75
  Bottom 0.406: 24.25,6.05 24.05,6.05 23.6,5.6 C12.1 22.4,5.6 22,6 22,7.95 | C9.1 7.15,17.1 6.95,17.3 IC3.1 | D2.A 9,17.75 7.75,16.5 C9.1 | C9.1 7.15,15.9 6.75,15.5 3.5,15.5 2.75,14.75 v2.75,11.75 | D5.C D4.C 66,4.25 63.75,2 v57,2 | 5,11.55 5,9.5 6.5,8 v17,8 | 22,7.95 IC4.3 | v22,8 22,7.95 | 24.25,6.05 v24.25,5.25 | 24.25,6.05 IC4.1
  Bottom 0.61: IC2.1 5,11.55 3.8,11.55 | 3.8,11.55 C5.1 | 3.8,11.55 2.95,11.55 v2.75,11.75
ALERM_LED  (via drill 0.3)
  Top 0.254: v54.75,12.5 51.5,12.5 49.5,14.5 v49.5,22
  Bottom 0.254: T2.1 47.1,3 48,3 49.25,4.25 54.5,4.25 55,4.75 55,12.25 v54.75,12.5 | IC1.69 48,23.5 v49.5,22
AMP_IN1  (via drill 0.3)
  Top 0.254: v50.75,28.75 54.5,32.5 64.5,32.5 65.5,33.5 65.5,40.5 v66.5,41.5
  Bottom 0.254: v66.5,41.5 C30.1 | IC1.74 50.5,28.5 v50.75,28.75
AMP_IN2A  (via drill 0.3)
  Top 0.254: J1.1 53.25,30 v51.5,28.25
  Bottom 0.254: IC1.75 51,27.75 v51.5,28.25
AMP_IN2B  (via drill 0.3)
  Top 0.254: v48.5,13.25 48.5,23 54.25,28.75 57.25,28.75 57.52,29.02 J1.3
  Bottom 0.254: IC1.6 v48.5,13.25
ATM_EN
  Bottom 0.254: IC7.4 IC7.5 54.62,26.62 53.5,25.5 51.75,25.5 51.5,25.25 51.5,23.25 51.75,23 IC1.80
EXT_POWER
  Bottom 0.406: D5.A 68.5,7.5 70.1,5.9 JTAG.7
GND  (via drill 0.3)
  Bottom 0.254: LCD1.3 LCD1.1 22.7,21.2 v22.75,21.25 | LCD1.33 LCD1.31 12.7,21.8 12.4,22.1 LCD1.32 12.4,25.35 12.1,25.65 C8.2 | IC4.2 23.5,7 C12.2 | Q2.3 Q2.2 | IC9.4 C34.2 37,39.75 37.75,40.5 R30.1 R29.1 | IC6.3 IC6.4 IC6.5 | IC6.3 IC6.2 62.5,24.2 C23.2 | Q1.4 37.6,4.2 C15.2 | Q1.2 38.9,5.8 C14.2 | C9.2 5.85,17.15 6,17.3 IC3.2 | LCD1.2 21.4,24.1 21.75,23.75 v22,23.75 | IC1.31 38.75,15.5 v38.75,14.75 v38.75,19.5 38.75,20 38.25,20.5 IC1.41 | 7.25,12.5 7.25,9.5 | 7.25,12.5 IC2.2 4.75,12.5 4.35,12.9 C5.2 | 7.25,12.5 12.5,12.5 | C3.2 C2.2 | C11.2 8,23 8.25,23.25 v8.25,23.75 | IC6.10 IC6.11 59.5,23.4 | 59.5,23.4 v59.5,23.25 | 59.5,23.4 IC6.3 | C19.2 C20.2 | R6.1 C4.2
  Bottom 0.406: C24.2 C25.2 62,27.88 IC7.3
  Bottom 0.61: C29.2 R18.1
  other vias: 50.75,24 4,14.75 46.25,14.25 41.5,9.5 54.75,19.25 9.25,10.62 3.5,16.5 13.25,9.75 25.75,24.75 10.75,14.75 33.5,13.75 55.5,28 46.25,21.75 45.25,29.25 19,9 52.25,3.5 22,4.75 51.75,27.25 64.5,23.25 64.5,21.25 35.95,24.75 30.5,7.25 37.75,11.5 44.5,9.5 43,4 21,1 45.75,3.5 48.75,8.25 36.5,42 36.5,40.5 36.5,32 64,4.5 65,30 64.5,19.5 21,9 2.5,16.5 12,18 13,18 55.75,35 53.25,38.25 51.75,33.5 53,26.5 56.5,28 29.75,8 37.25,10.75 62,26.5 63.5,26.5 31,12 52,37.25 66.5,18.5 68,24 25,1 41,1 44.25,14.25 57.75,13.5 68,19.5 43,6.5 54.25,6.5
  pour Bottom (isolate 0.13): 73.5,43.5 73.5,0.5 20.5,0.5 20.5,3.5 0.5,3.5 0.5,29.5 35.5,29.5 35.5,43.5
  pour Top (isolate 0.13): 73.5,0.5 73.5,43.5 35.5,43.5 35.5,29.5 0.5,29.5 0.5,3.5 20.5,3.5 20.5,0.5
GPIO1
  Bottom 0.254: IC1.46 36,23 33,26 GPIO1.1
GPIO2
  Bottom 0.254: IC1.47 36.25,23.5 34.75,25 GPIO2.1
GPIO3  (via drill 0.3)
  Bottom 0.254: IC1.57 42,28.5 v42.75,29.25
GPIO4  (via drill 0.3)
  Bottom 0.254: IC1.58 42.5,28 v43.75,29.25
GPIO5  (via drill 0.3)
  Bottom 0.254: IC1.59 43,27.75 43.75,28.5 v44.5,28.5
GPIO6  (via drill 0.3)
  Bottom 0.254: IC1.65 46,27.75 v45.5,28.25
GPIO7  (via drill 0.3)
  Bottom 0.254: IC1.66 46.5,25.5 47,25 47,22 v47.25,21.75
GPIO8  (via drill 0.3)
  Bottom 0.254: IC1.67 47,25.75 47.5,25.25 47.5,22.75 v47.75,22.5
GPIO9  (via drill 0.3)
  Bottom 0.254: IC1.9 47,8.5 v47.25,8.25
GPIO10  (via drill 0.3)
  Bottom 0.254: IC1.8 47.5,9.25 v48,8.75
GPIO11  (via drill 0.3)
  Bottom 0.254: IC1.7 48,10 v48.75,9.25
GSEN_CS
  Bottom 0.254: IC6.7 59.5,20.5 59.25,20.25 57,20.25 53.75,23.5 IC1.79
GSEN_INT1  (via drill 0.3)
  Top 0.254: v54,27 54.5,27 55.5,26 v55.5,23.25
  Bottom 0.254: IC1.52 39.5,29 40.5,30 51.25,30 54,27.25 v54,27 | IC6.8 57.75,21 v55.5,23.25
GSEN_INT2  (via drill 0.3)
  Top 0.254: v56.25,23.75 56.25,26 v54.5,27.75
  Bottom 0.254: IC1.51 39,29.25 40.25,30.5 51.75,30.5 v54.5,27.75 | IC6.9 57.95,21.8 56.25,23.5 v56.25,23.75
GSEN_SCLK  (via drill 0.3)
  Top 0.254: v54.75,23.75 v54.75,25.75
  Bottom 0.254: IC6.14 59.5,25.5 59.25,25.75 v54.75,25.75 | IC1.78 54.5,24 v54.75,23.75
GSEN_SDI
  Bottom 0.254: IC1.76 IC6.13
GSEN_SDO
  Bottom 0.254: IC6.12 57.8,24.2 57.5,24.5 IC1.77
I2C_SCL  (via drill 0.3)
  Top 0.254: v39,24.25 39.5,23.75 41.5,23.75 43,22.25 44.75,22.25 47.5,25 47.5,32.25 | v47,37 47.5,36.5 47.5,32.25 | 47.5,32.25 v47.25,32.25
  Bottom 0.254: IC9.6 46.87,37.13 v47,37 R24.1 | v39,24.25 38.75,24.5 IC1.49 | v47.25,32.25 51.5,32.25 53.38,30.38 IC7.8
I2C_SDA  (via drill 0.3)
  Top 0.254: v39,23.25 41.25,23.25 42.75,21.75 45,21.75 48,24.75 48,31.5 | 48,31.5 48,36.5 v48.5,37 | 48,31.5 v48.25,31.5
  Bottom 0.254: IC1.48 38.25,24 v39,23.25 | v48.5,37 48.55,36.95 | v48.25,31.5 51.5,31.5 53.88,29.12 IC7.7 | v48.5,37 R23.1 | v48.5,37 47.09,38.41 IC9.5
IR_LED  (via drill 0.3)
  Top 0.254: v55.25,13.25 51.5,13.25 50.25,14.5 v50.25,21.5
  Bottom 0.254: T3.1 54.45,2.95 55.5,4 55.5,13 v55.25,13.25 | IC1.70 48.5,24 50.25,22.25 v50.25,21.5
IRDA_RXD  (via drill 0.3)
  Top 0.254: v59,4.5 59.1,4.4 IC5.2
  Bottom 0.254: IC1.82 53.75,22 56.5,19.25 56.5,5.75 57.75,4.5 v59,4.5
IRDA_SD  (via drill 0.3)
  Top 0.254: IC5.4 v61,4.5
  Bottom 0.254: IC1.81 54,22.5 57,19.5 57,6 57.75,5.25 60.25,5.25 v61,4.5
IRDA_TXD  (via drill 0.3)
  Top 0.254: v60,4.5 60.05,4.45 IC5.3
  Bottom 0.254: IC1.85 54.5,20.5 56,19 56,5.5 57.75,3.75 59.25,3.75 v60,4.5
ISP_HANDLER  (via drill 0.3)
  Top 0.254: v40.75,29.25 v38.25,29.25
  Bottom 0.254: IC1.53 40,28.5 v40.75,29.25 | J2.1 R31.1 39.65,30.65 v38.25,29.25
JTAG_RESET  (via drill 0.3)
  Top 0.254: v43.25,12.75 46.5,12.75 v51,8.25 60.5,8.25 62.5,10.25 v65.75,10.25 67.56,8.44 JTAG.6
  Bottom 0.254: IC1.17 43,12.5 v43.25,12.75 | v51,8.25 R12.1 | C26.2 68.75,13.25 v65.75,10.25
JTAG_TCLK_SWCLK  (via drill 0.3)
  Top 0.254: JTAG.3 66.06,16.06 60.75,10.75 51.25,10.75 v49.25,12.75
  Bottom 0.254: v49.25,12.75 49,12.5 IC1.5
JTAG_TDI  (via drill 0.3)
  Top 0.254: JTAG.5 62.48,10.98 60.25,8.75 51.5,8.75 v50.75,9.5
  Bottom 0.254: v50.75,9.5 50.5,9.75 IC1.2
JTAG_TDO_SWO  (via drill 0.3)
  Top 0.254: JTAG.4 64.27,13.52 60,9.25 52,9.25 v51.75,9.5
  Bottom 0.254: IC1.1 51,10.25 v51.75,9.5
JTAG_TMS_SWDIO  (via drill 0.3)
  Top 0.254: v50.25,12.75 51.75,11.25 60.5,11.25 67.85,18.6 JTAG.2
  Bottom 0.254: v50.25,12.75 50,12.5 IC1.3
LCD_CS  (via drill 0.3)
  Top 0.254: v26.25,12 27,12 31,16 41.25,16 v41.5,15.75
  Bottom 0.254: LCD1.27 13.9,19.35 21.25,12 v26.25,12 | v41.5,15.75 IC1.20
LCD_D0  (via drill 0.3)
  Top 0.254: v47,15.25 46.75,15 43.5,15 42,16.5 30.75,16.5 27,12.75 v26.75,12.75
  Bottom 0.254: IC1.95 47.25,15.5 v47,15.25 | LCD1.25 14.5,19.5 21.25,12.75 v26.75,12.75
LCD_D1  (via drill 0.3)
  Top 0.254: v46.25,15.75 46.25,17.25 41,22.5 34.75,22.5 v32.5,24.75
  Bottom 0.254: LCD1.24 14.8,25.8 16.5,27.5 29.75,27.5 v32.5,24.75 | IC1.94 46.5,16 v46.25,15.75
LCD_D2  (via drill 0.3)
  Top 0.254: v45.5,16.25 45.25,16 43.25,16 42.25,17 30.5,17 27,13.5 v26.25,13.5
  Bottom 0.254: LCD1.23 15.1,19.65 21.25,13.5 v26.25,13.5 | IC1.93 45.75,16.5 v45.5,16.25
LCD_D3  (via drill 0.3)
  Top 0.254: v44.75,16.75 44.75,18 40.75,22 34.25,22 v32.5,23.75
  Bottom 0.254: LCD1.22 15.4,25.65 16.75,27 29.25,27 v32.5,23.75 | IC1.92 45,17 v44.75,16.75
LCD_D4  (via drill 0.3)
  Top 0.254: v44,17.25 43.75,17 43,17 42.5,17.5 30.25,17.5 27,14.25 v26.75,14.25
  Bottom 0.254: LCD1.21 15.7,19.8 21.25,14.25 v26.75,14.25 | IC1.91 44.25,17.5 v44,17.25
LCD_D5  (via drill 0.3)
  Top 0.254: v43.25,17.75 43.25,18.75 40.5,21.5 33.75,21.5 v31.5,23.75
  Bottom 0.254: LCD1.20 16,25.5 17,26.5 28.75,26.5 v31.5,23.75 | IC1.90 43.5,18 v43.25,17.75
LCD_D6  (via drill 0.3)
  Top 0.254: v42.5,18.25 42.25,18 30,18 27,15 v26.25,15
  Bottom 0.254: LCD1.19 16.3,19.95 21.25,15 v26.25,15 | IC1.89 42.75,18.5 v42.5,18.25
LCD_D7  (via drill 0.3)
  Top 0.254: v41.75,18.75 41.75,19.5 40.25,21 33.25,21 v31.5,22.75
  Bottom 0.254: LCD1.18 16.6,25.35 17.25,26 28.25,26 v31.5,22.75 | IC1.88 42,19 v41.75,18.75
LCD_D8  (via drill 0.3)
  Top 0.254: v41,19.25 40.25,18.5 29.75,18.5 27,15.75 v26.75,15.75
  Bottom 0.254: LCD1.17 16.9,20.1 21.25,15.75 v26.75,15.75 | IC1.87 41.25,19.5 v41,19.25
LCD_D9  (via drill 0.3)
  Top 0.254: v40.25,19.75 40.25,20.25 40,20.5 32.75,20.5 v30.5,22.75
  Bottom 0.254: LCD1.16 17.2,25.2 17.5,25.5 27.75,25.5 v30.5,22.75 | IC1.86 40.5,20 v40.25,19.75
LCD_D10
  Bottom 0.254: LCD1.15 17.5,20.25 21.25,16.5 IC1.33
LCD_D11  (via drill 0.3)
  Top 0.254: v20.5,18.25 20.5,19.5 v17.25,22.75
  Bottom 0.254: v17.25,22.75 17.8,23.3 LCD1.14 | IC1.34 21.75,17 v20.5,18.25
LCD_D12
  Bottom 0.254: LCD1.13 18.1,20.4 19.5,19 20.75,19 22.25,17.5 IC1.35
LCD_D13  (via drill 0.3)
  Top 0.254: v22.5,18.25 22.5,18.5 v18.25,22.75
  Bottom 0.254: LCD1.12 18.4,22.9 v18.25,22.75 | IC1.36 22.75,18 v22.5,18.25
LCD_D14
  Bottom 0.254: LCD1.11 18.7,20.55 19.75,19.5 22.25,19.5 23.25,18.5 IC1.37
LCD_D15  (via drill 0.3)
  Top 0.254: v23.5,19.25 22.75,19.25 v19.25,22.75
  Bottom 0.254: v19.25,22.75 19,23 LCD1.10 | IC1.38 23.75,19 v23.5,19.25
LCD_D16
  Bottom 0.254: LCD1.9 19.3,20.7 20,20 23.75,20 24.25,19.5 IC1.39
LCD_D17  (via drill 0.3)
  Top 0.254: v24.5,20.25 22.75,20.25 v20.25,22.75
  Bottom 0.254: v20.25,22.75 19.6,23.4 LCD1.8 | IC1.40 24.75,20 v24.5,20.25
LCD_LED
  Bottom 0.254: LCD1.4 20.8,23.95 21.75,23 24.5,23 R8.2
LCD_LED_EN  (via drill 0.3)
  Top 0.254: v46.75,28.75 45.5,30 38,30 37,29 30.25,29 v30,28.75
  Bottom 0.254: IC3.4 5.05,23.3 5.75,24 7.5,24 11.25,27.75 14,27.75 15.5,29.25 16,29.25 16.75,28.5 29.75,28.5 v30,28.75 | IC1.68 47.5,28 v46.75,28.75
LCD_RESET
  Bottom 0.254: 20.5,21.25 LCD1.5 20.5,21.75 20.75,22 23,22 23.5,21.5 IC1.43
LCD_RS
  Bottom 0.254: LCD1.26 14.2,25.95 16.25,28 30.25,28 35.75,22.5 IC1.45
LCD_WR
  Bottom 0.254: IC1.44 23.75,22 23.25,22.5 21.5,22.5 20.2,23.8 LCD1.6
N$1  (via drill 0.3)
  Top 0.254: X1.M1 v18,5
  Bottom 0.254: C4.1 R6.2 v18,5
N$2  (via drill 0.3)
  Top 0.406: X1.2 10.35,8.85 v10.25,9
  Bottom 0.254: R1.1 11.85,10.6 v10.25,9
N$3  (via drill 0.3)
  Top 0.406: X1.3 11,8.75 v11.25,9
  Bottom 0.254: v11.25,9 16.75,9 17.75,10 R2.1
N$4
  Top 0.406: X1.1 9.7,8.3 9,9
  Top 0.61: 9,9 6,9 5.5,8.5 5.5,5.5 4.8,4.8 L1.2
N$5  (via drill 0.3)
  Top 0.254: v42.25,12.75 43,13.5 46.5,13.5 49.75,10.25 58.75,10.25 v59,10
  Bottom 0.254: IC1.19 42,12.5 v42.25,12.75 | R15.2 59.25,13.5 59,13.25 D3.C v59,10
N$6
  Bottom 0.254: R7.2 33.5,9.75 T1.3
N$7
  Bottom 0.254: IC1.29 32.5,14.5 27.75,9.75 | C3.1 R2.2 18.35,11.9 20.5,9.75 27.75,9.75 | 27.75,9.75 R7.1
N$8
  Bottom 0.254: 46.5,10 IC1.10 | L3.2 46.5,10 | IC1.12 45.5,10.25 45.75,10 46.5,10
N$9
  Bottom 0.254: IC1.30 32.25,15 27.5,10.25 20.75,10.25 18.25,12.75 15.5,12.75 15.25,12.5 C2.1 R1.2
N$10
  Bottom 0.406: IC3.3 5.05,18.3 4.75,18 4.25,18 3.65,18.6 C10.2
N$11
  Bottom 0.254: C15.1 38.9,4.2 Q1.3 40.2,4.2 40.5,4.5 IC1.22
N$12
  Bottom 0.254: Q1.1 37.6,5.8 C14.1 37.6,8.1 38,8.5 39.5,8.5 40,9 IC1.23
N$13  (via drill 0.3)
  Top 0.254: v17.75,9 v17.75,14.25
  Bottom 0.254: IC1.32 31.75,16 27,11.25 21.25,11.25 18.25,14.25 v17.75,14.25 | v17.75,9 17.75,6 16.75,5 7.25,5 6.85,4.6 R4.1
N$14
  Bottom 0.254: R4.2 LED1.C
N$15
  Bottom 0.254: C17.1 Q2.1 43.5,8.15 IC1.16
N$16
  Bottom 0.254: C16.1 Q2.4 42.5,8.15 IC1.18
N$17
  Bottom 0.254: C10.1 3,20
  Bottom 0.406: IC3.6 6.95,20.45 6.5,20 3,20
N$18
  Bottom 0.254: R11.2 IC1.4
N$19
  Bottom 0.406: D4.A 66,9.25 69.5,12.75 69.5,33 70.34,33.84 SERIAL.4
N$20  (via drill 0.3)
  Top 0.254: v23,24.5 16.5,24.5 15.75,25.25 v15.75,28.5
  Bottom 0.254: v15.75,28.5 14.5,27.25 11.5,27.25 9,24.75 D2.C 8.25,21.5 7.75,22 6,22 | 6,22 6,23 C11.1 | IC3.5 6,22 | v23,24.5 24.5,24.5 R8.1
N$21
  Bottom 0.254: R15.1 61.15,14.9 63,16.75 C22.+
N$22  (via drill 0.3)
  Top 0.254: v17,7 17.25,7.25 27.75,7.25 33.25,12.75 v40.75,12.75
  Bottom 0.254: IC1.21 41,12.5 v40.75,12.75 | R5.1 v17,7
N$23
  Bottom 0.254: L4.1 61.88,20.25 61.12,21 IC6.6
N$24  (via drill 0.3)
  Top 0.254: IC5.6 62.9,4.4 v63,4.5
  Bottom 0.254: C19.1 61.9,7.4 61.5,7 61.5,6.1 | 61.5,6.1 R14.1 | v63,4.5 63,5 62.75,5.25 62,5.25 61.5,5.75 61.5,6.1
N$25
  Bottom 0.406: L2.2 10.75,11.55
  Bottom 0.61: 10.75,11.55 IC2.5 | C6.1 9.5,9.5 10.75,10.75 L2.2
N$27
  Bottom 0.254: C26.1 68.75,40 70.21,41.46 SERIAL.1
N$28  (via drill 0.3)
  Top 0.254: v65.5,31.25 56.25,31.25 56,31 J1.2
  Bottom 0.254: C32.1 66.4,31.9 66.25,31.25 v65.5,31.25
N$30  (via drill 0.3)
  Top 0.406: LED3.C 51.25,1.75 v51.25,3.5
  Bottom 0.406: T3.3 51.25,2 v51.25,3.5
N$31  (via drill 0.3)
  Top 0.406: LED2.C 44.75,1.75 v44.75,3.5
  Bottom 0.406: T2.3 44.75,2 v44.75,3.5
N$32  (via drill 0.3)
  Top 0.254: v40.5,42 41,41.5 v41,34.59
  Bottom 0.254: R27.1 v40.5,42 R29.2 | IC9.1 v41,34.59
N$33
  Bottom 0.254: IC9.2 40.62,35.87 41.25,36.5 41.25,39 40.5,39.75 40.5,40.5 | 40.5,40.5 R28.1 | 40.5,40.5 R30.2
N$34
  Top 0.406: 54.3,2.15 LED3.A 54.3,0.85 R10.1
N$35  (via drill 0.3)
  Top 0.254: IC5.1 58.15,5.85 v58,6
  Bottom 0.254: R13.1 58.1,6.1 v58,6
N$40
  Bottom 0.406: C31.2 51.5,41.5 AOUT1.1
N$41
  Top 0.406: R9.1 47.8,0.85 LED2.A
N$43
  Bottom 0.254: IC9.7 43.38,35.87 42.75,36.5 42.75,38.75 43.5,39.5 45.75,39.5 46.15,39.9 R26.1 R25.2
N$51
  Bottom 0.406: IC10.2 59.17,40.17 59.4,40.4 R20.1
  Bottom 0.61: 59.37,41.5 R20.1 R19.2
N$52
  Bottom 0.406: IC10.5 60.47,32.5 R22.1
  Bottom 0.61: 60.38,32.5 R22.1 R21.2
N$53
  Bottom 0.61: R19.1 C30.2
N$54
  Bottom 0.61: R21.1 C32.2
N$56  (via drill 0.3)
  Top 0.61: v58.5,36.35 60.6,36.35 v62,37.75
  Bottom 0.406: C27.1 63.85,37.75 C28.1 | IC10.8 58.52,36.35 v58.5,36.35
  Bottom 0.61: v62,37.75 C27.1 | v58.5,36.35 R16.2 R17.1
N$57
  Bottom 0.406: IC10.3 59.82,37.65 59.85,37.65 | IC10.6 59.82,35.57 60.25,36 61.75,36
  Bottom 0.61: C29.1 R18.2 61.75,36 61.5,36 59.85,37.65 R16.1
N$58
  Bottom 0.406: AOUT2.1 48,39.75 53.6,34.15 C33.2
N$59
  Bottom 0.406: C33.1 56.4,32.5 R22.2 59.17,32.5 IC10.7
N$60
  Bottom 0.406: IC10.1 58.52,40.23 58.1,40.65 R20.2
  Bottom 0.61: C31.1 R20.2
N$63
  Bottom 0.406: C25.1 62,29.12 IC7.2
RSTOUT  (via drill 0.3)
  Bottom 0.254: IC1.14 44.5,12.5 43.25,13.75 v42.25,13.75
SD_CLK  (via drill 0.3)
  Top 0.254: v44.75,24.25 43.25,24.25 40.5,27 31.5,27 27.5,23 27.5,20 23.5,16 17,16 16,15 11.75,15 11.25,15.5 10.5,15.5 9.4,14.4 SLOT1.5 9.4,12.6 9.75,12.25 10.75,12.25 11.2,11.8 RN2.4
  Bottom 0.254: IC1.62 44.5,24.5 v44.75,24.25
SD_CMD/DI  (via drill 0.3)
  Top 0.254: RN1.2 7,12.25 7.2,12.45 SLOT1.3 7.2,14.2 9,16 11.5,16 12,15.5 15.75,15.5 16.75,16.5 23.25,16.5 27,20.25 27,23.25 31.25,27.5 41,27.5 v43.25,25.25
  Bottom 0.254: IC1.60 43.5,25.5 v43.25,25.25
SD_DAT0/DO  (via drill 0.3)
  Top 0.254: v43.5,23.5 43.25,23.5 40.25,26.5 31.75,26.5 28,22.75 28,19.75 23.75,15.5 17.25,15.5 16.25,14.5 12,14.5 11.6,14.1 SLOT1.7 11.6,12.15 11.75,12 RN2.3
  Bottom 0.254: IC1.61 44,24 v43.5,23.5
SD_DAT1
  Top 0.254: RN2.2 12.25,12 12.7,12.45 SLOT1.8
SD_DAT2
  Top 0.254: SLOT1.1 5,12.75 5.95,11.8 RN1.4
SD_DAT3/CS  (via drill 0.3)
  Top 0.254: RN1.3 6.5,12.25 6.1,12.65 SLOT1.2 6.1,14.1 8.5,16.5 11.75,16.5 12.25,16 15.5,16 16.5,17 23,17 26.5,20.5 26.5,23.5 31,28 41.5,28 44.5,25 v45.25,25
  Bottom 0.254: IC1.63 45,25.25 v45.25,25
SD_DETECT  (via drill 0.3)
  Top 0.254: v39.75,25.45 39.2,26 32,26 28.5,22.5 28.5,19.5 24,15 17.5,15 16.5,14 13.65,14 SLOT1.9 13.65,12.65 12.8,11.8 RN2.1
  Bottom 0.254: IC1.50 39.3,25 v39.75,25.45
SD_PWR_EN  (via drill 0.3)
  Top 0.254: v5,14.75 7.25,17 12,17 12.5,16.5 15.25,16.5 16.25,17.5 22.75,17.5 26,20.75 26,23.75 30.75,28.5 41,28.5 v41.75,29.25
  Bottom 0.254: IC2.3 5.3,13.45 5,13.75 v5,14.75 | IC1.56 41.5,29 v41.75,29.25
SERIAL_RXD  (via drill 0.3)
  Top 0.254: v54.5,14.75 54.75,15 61,15 66.75,20.75 66.75,35.5 70.17,38.92 SERIAL.2
  Bottom 0.254: IC1.98 53.75,14 v54.5,14.75
SERIAL_TXD  (via drill 0.3)
  Top 0.254: SERIAL.3 70.13,36.38 67.25,33.5 67.25,20.5 61.25,14.5 55.5,14.5 v55.25,14.25
  Bottom 0.254: IC1.99 54.5,13.5 v55.25,14.25
SW1  (via drill 0.3)
  Top 0.254: v31.5,7.25 v35.75,11.5
  Bottom 0.254: IC1.27 36,13.5 35.5,13 35.5,11.75 v35.75,11.5 | v31.5,7.25 31.5,6.5 28.5,3.5 SW1.1
SW2  (via drill 0.3)
  Top 0.254: v32.5,7.25 v36.75,11.5
  Bottom 0.254: IC1.26 36.25,13 36,12.75 36,12.25 v36.75,11.5 | v32.5,7.25 32.5,6.75 30.25,4.5 SW2.1
SW3
  Bottom 0.254: IC1.25 39,10.5 38.5,10 36.75,10 35.5,8.75 35.5,7.5 32,4 SW3.1
SW4
  Bottom 0.254: IC1.24 39.5,10.25 38.75,9.5 37,9.5 36,8.5 36,7.25 33.75,5 SW4.1
USB_CONNECT  (via drill 0.3)
  Top 0.254: v30,11 26.25,11 25.5,11.75 25.5,15.75 29,19.25 29,22.25 32.25,25.5 38.75,25.5 40,24.25 41.75,24.25 43.25,22.75 44.25,22.75 v45.75,24.25
  Bottom 0.254: IC1.64 45.5,25.75 46,25.25 46,24.5 v45.75,24.25 | T1.1 32.55,11.3 32.25,11 v30,11
VBUS  (via drill 0.3)
  Top 0.61: L1.1 2.75,8.7 v2.75,10.5 2.25,11 D1.A v1.25,12.5
  Bottom 0.254: R5.2 6.25,7 v2.75,10.5
  Bottom 0.61: v1.25,12.5 C1.1
VCC  (via drill 0.3)
  Top 0.254: 8.3,10.53 SLOT1.4 | 8.3,10.53 RN1.8 RN1.7 RN1.6 RN1.5 | 8.3,10.53 9.07,9.75 11.75,9.75 12.25,10.25 RN2.7 | RN2.7 RN2.8 | RN2.7 RN2.6
  Top 0.406: SLOT1.4 8.3,14.3 v8.75,14.75
  Bottom 0.406: v8.75,14.75 10,13.5 L2.1
  Bottom 0.61: C7.1 10.75,13.65 L2.1
VIBRATOR  (via drill 0.3)
  Top 0.254: v49.75,28.75 49.75,32 v50.75,33
  Bottom 0.254: IC1.73 50,28.5 v49.75,28.75

### Text on the board
tPlace: (C)2011 CITERA | MINTIA Display Rev A | http://www.citera.info/ | PWM / AOUT | G3 | G4 | G5 | G6 | G8 | G7 | RSTOUT | G11 | G10 | G9 | Designed by Taguchi
bPlace: DTR | RXD | TXD | PWR | ISP_EN | G3 | G4 | CTS | G5 | G6 | GND | G11 | G10 | G9